# Altium schematic sheet SRRadio.SchDoc
size A4
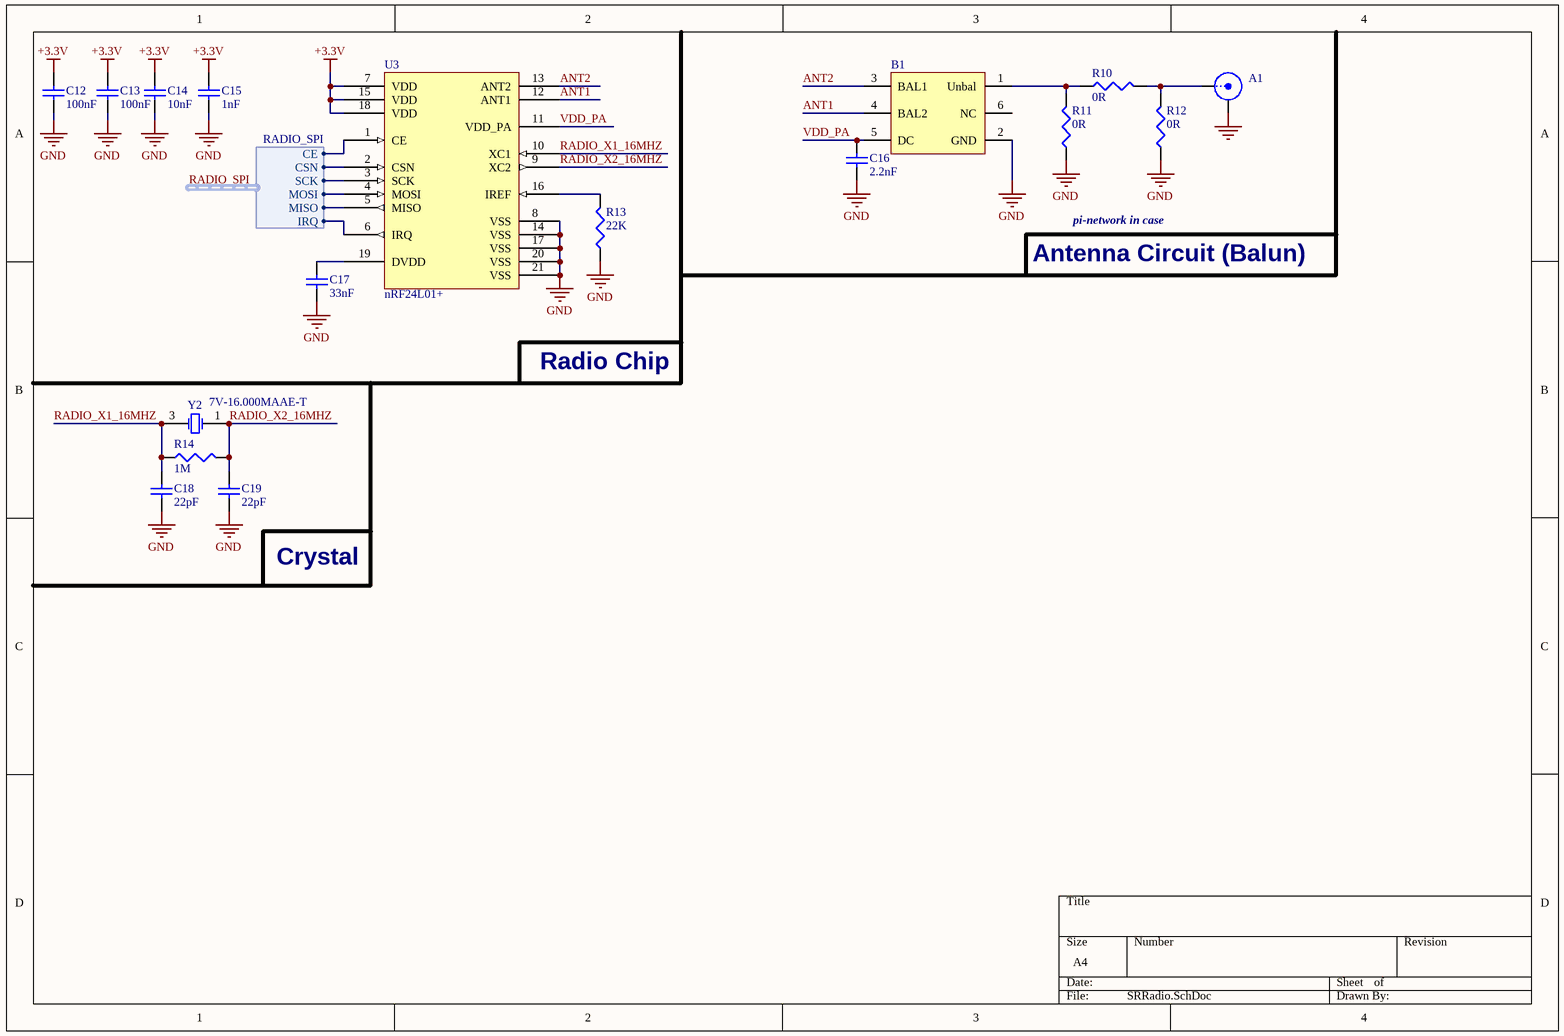
[diagram p0: SRRadio.SchDoc]

## Parts
A1  142-4701-801  [142-4701-801]  (value not drawn)
B1  2450BM14A0002T  [2450BM14A0002]  (value not drawn)
C12  100nF  [0402]
C13  100nF  [0402]
C14  10nF  [0402]
C15  1nF  [0402]
C16  2.2nF  [0402]
C17  33nF  [0402]
C18  22pF  [0402]
C19  22pF  [0402]
R10  0R  [0402]
R11  0R  [0402]
R12  0R  [0402]
R13  value 22K  [0402]  (hidden comment: 22K 0402 1/16W ±1%)
R14  1M  [0402]
U3  nRF24L01+  [QFN50P400X400X95_HS-21L]
Y2  7V-16.000MAAE-T  [3.2x2.5 CRYSTAL]

## Harnesses
RADIO_SPI: MOSI, MISO, SCK, CSN, CE, IRQ

## Nets
+3.3V: C12.2 C13.2 C14.2 C15.2 U3.7(VDD) U3.15(VDD) U3.18(VDD)
GND: A1.2(Y) B1.2(GND) C12.1 C13.1 C14.1 C15.1 C16.1 C17.1 C18.1 C19.1 R11.1 R12.1 R13.1 U3.8(VSS) U3.14(VSS) U3.17(VSS) U3.20(VSS) U3.21(VSS) Y2.2(GND) Y2.4(GND)
ANT1: B1.4(BAL2) U3.12(ANT1)
ANT2: B1.3(BAL1) U3.13(ANT2)
RADIO_SPI.CE: U3.1(CE) ; harness RADIO_SPI.CE
RADIO_SPI.CSN: U3.2(CSN) ; harness RADIO_SPI.CSN
RADIO_SPI.IRQ: U3.6(IRQ) ; harness RADIO_SPI.IRQ
RADIO_SPI.MISO: U3.5(MISO) ; harness RADIO_SPI.MISO
RADIO_SPI.MOSI: U3.4(MOSI) ; harness RADIO_SPI.MOSI
RADIO_SPI.SCK: U3.3(SCK) ; harness RADIO_SPI.SCK
RADIO_X1_16MHZ: C18.2 R14.1 U3.10(XC1) Y2.3(X2)
RADIO_X2_16MHZ: C19.2 R14.2 U3.9(XC2) Y2.1(X1)
VDD_PA: B1.5(DC) C16.2 U3.11(VDD_PA)
NetA1_1: A1.1(X) R10.2 R12.2
NetB1_1: B1.1(Unbal) R10.1 R11.2
NetC17_2: C17.2 U3.19(DVDD)
NetR13_2: R13.2 U3.16(IREF)

Not connected (* = marked no-connect by the designer): B1 6(NC)

## Notes on the sheet
- pi-network in case
- Antenna Circuit (Balun)
- Radio Chip
- Crystal

## Library data of the parts
A1 = 142-4701-801: JOHNSON  142-4701-801  SMA FEMELLE REVERSE POLARITY TERMINAISON; Supplier 1: Farnell; Supplier Part Number 1: 2340523; Supplier 2: Digi-Key; Supplier Part Number 2: J917-ND
B1 = 2450BM14A0002T: Johanson Technology Impedance Matched Balun Filter Integrated Passive for nRF24L01; Supplier 1: Farnell; Supplier 2: Digi-Key; Supplier Part Number 1: 2148533; Supplier Part Number 2: 712-1574-1-ND
C12 C13 = 100nF: 100nF 0402 X7R 16V ±10%; Supplier 1: Farnell; Supplier Part Number 1: 1288252; Supplier 2: Digi-Key; Supplier Part Number 2: 399-3521-1-ND; Value: 100nF
C14 = 10nF: 10nF 0402 X7R 25V ±5%; Supplier 1: Farnell; Supplier Part Number 1: 1692285; Supplier 2: Digi-Key; Supplier Part Number 2: 399-1279-1-ND; Value: 10nF
C15 = 1nF: 1nF 0402 X7R 50V ±10%; Supplier 1: Farnell; Supplier 2: Digi-Key; Supplier Part Number 1: 1414573; Supplier Part Number 2: 399-1032-1-ND; Value: 1nF
C16 = 2.2nF: 2.2nF 0402 X7R 50V ±10%; Supplier 1: Farnell; Supplier 2: Digi-Key; Supplier Part Number 1: 1414582; Supplier Part Number 2: 399-3068-1-ND; Value: 2.2nF
C17 = 33nF: 33nF 0402 X7R 50V ±10%; Supplier 1: Farnell; Supplier 2: Digi-Key; Supplier Part Number 1: 2210826; Supplier Part Number 2: 445-7334-1-ND; Value: 33nF
C18 C19 = 22pF: 22pF 0402 NP0/CG0 50V ±5%; Supplier 1: Farnell; Supplier 2: Digi-Key; Supplier Part Number 1: 1414580; Supplier Part Number 2: 490-5868-1-ND; Value: 22pF
R10-R12 = 0R: 0R 0402 1/16W ±0.05R; Supplier 1: Farnell; Supplier 2: Digi-Key; Supplier Part Number 1: 2072513; Supplier Part Number 2: P0.0JCT-ND; Value: 0R
R13 = 22K: Supplier 1: Farnell; Supplier 2: Digi-Key; Supplier Part Number 1: 2072781; Supplier Part Number 2: 541-22.0KLCT-ND
R14 = 1M: 1M 0402 1/16W ±1%; Supplier 1: Farnell; Supplier Part Number 1: 2072521; Supplier 2: Digi-Key; Supplier Part Number 2: P1.00MLCT-ND; Value: 1M
U3 = nRF24L01+: Nordic Semi Ultra low power 2.4GHz RF Transceiver IC; Supplier 1: Digi-Key; Supplier Part Number 1: 1490-1033-1-ND
Y2 = 7V-16.000MAAE-T: TXC - 7V-16.000MAAE-T, 16MHZ, 30PPM, 12PF - CRYSTAL; Supplier 1: Digi-Key; Supplier 2: Farnell; Supplier Part Number 1: 887-1462-1-ND; Supplier Part Number 2: 1892172